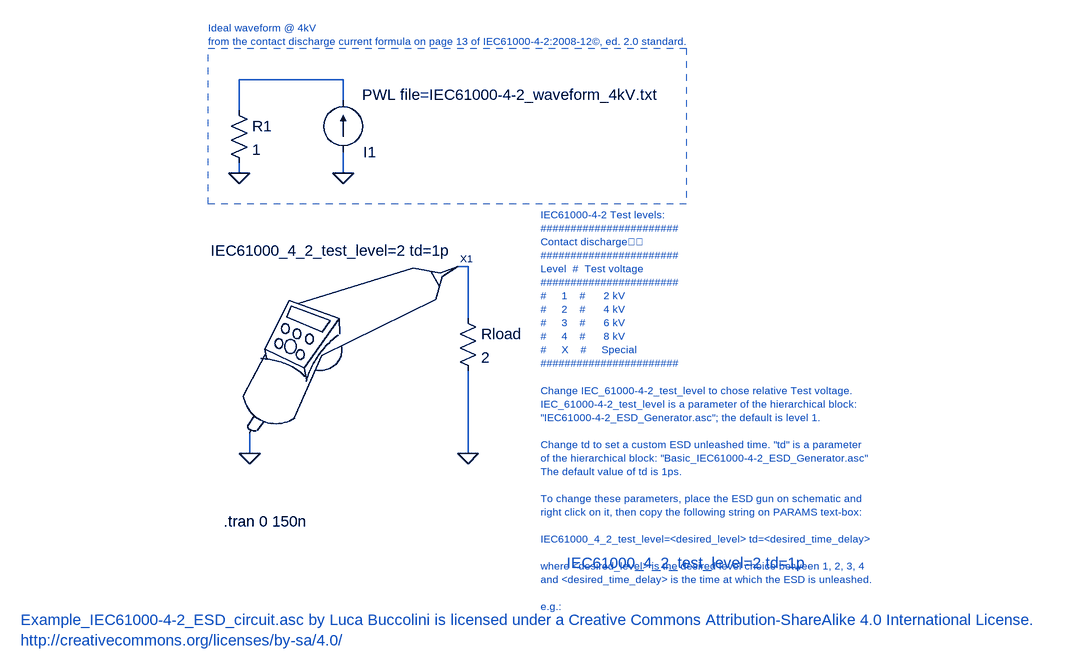
[diagram p0: schematic Example_IEC61000-4-2_ESD_circuit.asc]
Example_IEC61000-4-2_ESD_circuit.asc, the LTspice schematic file:
Version 4
SHEET 1 2940 680
WIRE 176 -224 16 -224
WIRE 176 -192 176 -224
WIRE 16 -176 16 -224
WIRE 16 -80 16 -96
WIRE 176 -80 176 -112
WIRE 368 64 352 64
WIRE 368 144 368 64
WIRE 32 352 32 320
WIRE 368 352 368 224
FLAG 32 352 0
FLAG 368 352 0
FLAG 16 -80 0
FLAG 176 -80 0
SYMBOL res 352 128 R0
SYMATTR InstName Rload
SYMATTR Value 2
SYMBOL res 0 -192 R0
SYMATTR InstName R1
SYMATTR Value 1
SYMBOL current 176 -112 R180
WINDOW 0 -51 0 Left 2
WINDOW 3 -489 89 Left 2
WINDOW 123 24 28 Left 2
WINDOW 39 0 0 Left 2
SYMATTR InstName I1
SYMATTR Value PWL file=IEC61000-4-2_waveform_4kV.txt
SYMBOL IEC61000-4-2_ESD_Generator 112 208 R0
WINDOW 39 -140 -169 Left 2
SYMATTR SpiceLine IEC61000_4_2_test_level=2 td=1p
SYMATTR InstName X1
TEXT -8 456 Left 2 !.tran 0 150n
TEXT 480 -16 Left 1 ;IEC61000-4-2 Test levels:\n#######################\nContact discharge         \n#######################\nLevel  #  Test voltage   \n#######################\n#     1    #      2 kV         \n#     2    #      4 kV         \n#     3    #      6 kV         \n#     4    #      8 kV         \n#     X    #     Special     \n#######################\n \nChange IEC_61000-4-2_test_level to chose relative Test voltage.\nIEC_61000-4-2_test_level is a parameter of the hierarchical block: \n"IEC61000-4-2_ESD_Generator.asc"; the default is level 1.\n \nChange td to set a custom ESD unleashed time. "td" is a parameter \nof the hierarchical block: "Basic_IEC61000-4-2_ESD_Generator.asc" \nThe default value of td is 1ps.\n \nTo change these parameters, place the ESD gun on schematic and \nright click on it, then copy the following string on PARAMS text-box:\n \nIEC61000_4_2_test_level=<desired_level> td=<desired_time_delay>\n \nwhere <desired_level> is the desired level choice between 1, 2, 3, 4\nand <desired_time_delay> is the time at which the ESD is unleashed.\n \ne.g.:
TEXT -32 -304 Left 1 ;Ideal waveform @ 4kV \nfrom the contact discharge current formula on page 13 of IEC61000-4-2:2008-12©, ed. 2.0 standard.
TEXT 520 520 Left 2 ;IEC61000_4_2_test_level=2 td=1p
TEXT -320 608 Left 2 ;Example_IEC61000-4-2_ESD_circuit.asc by Luca Buccolini is licensed under a Creative Commons Attribution-ShareAlike 4.0 International License.\nhttp://creativecommons.org/licenses/by-sa/4.0/
RECTANGLE Normal 704 -32 -32 -272 2

The netlist it stands for:
* Example_IEC61000-4-2_ESD_circuit.asc
Rload N002 0 2
R1 N001 0 1
I1 0 N001 PWL file=IEC61000-4-2_waveform_4kV.txt
XX1 N002 0 IEC61000-4-2_ESD_Generator params: IEC61000_4_2_test_level=2 td=1p  ; pins ESD GND
.tran 0 150n
* IEC61000-4-2 Test levels:
* #######################
* Contact discharge
* #######################
* Level  #  Test voltage
* #######################
* #     1    #      2 kV
* #     2    #      4 kV
* #     3    #      6 kV
* #     4    #      8 kV
* #     X    #     Special
* #######################
* Change IEC_61000-4-2_test_level to chose relative Test voltage.
* IEC_61000-4-2_test_level is a parameter of the hierarchical block:
* "IEC61000-4-2_ESD_Generator.asc"; the default is level 1.
* Change td to set a custom ESD unleashed time. "td" is a parameter
* of the hierarchical block: "Basic_IEC61000-4-2_ESD_Generator.asc"
* The default value of td is 1ps.
* To change these parameters, place the ESD gun on schematic and
* right click on it, then copy the following string on PARAMS text-box:
* IEC61000_4_2_test_level=<desired_level> td=<desired_time_delay>
* where <desired_level> is the desired level choice between 1, 2, 3, 4
* and <desired_time_delay> is the time at which the ESD is unleashed.
* e.g.:
* Ideal waveform @ 4kV
* from the contact discharge current formula on page 13 of IEC61000-4-2:2008-12©, ed. 2.0 standard.
* IEC61000_4_2_test_level=2 td=1p
* Example_IEC61000-4-2_ESD_circuit.asc by Luca Buccolini is licensed under a Creative Commons Attribution-ShareAlike 4.0 International License.
* http://creativecommons.org/licenses/by-sa/4.0/
.backanno
.end